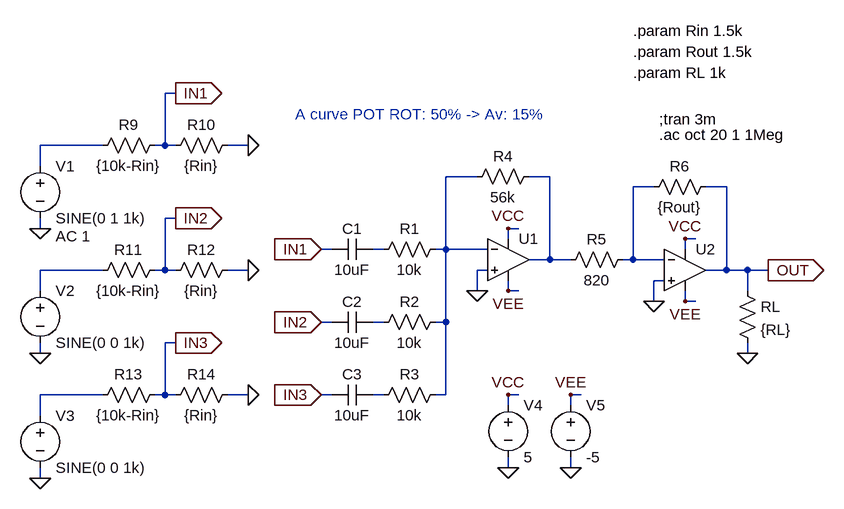
[diagram p0: schematic MIX0301.asc]
MIX0301.asc, the LTspice schematic file:
Version 4
SHEET 1 1024 708
WIRE -272 -80 -288 -80
WIRE -384 0 -480 0
WIRE -288 0 -288 -80
WIRE -288 0 -304 0
WIRE -272 0 -288 0
WIRE -160 0 -192 0
WIRE -480 32 -480 0
WIRE 192 48 144 48
WIRE 304 48 272 48
WIRE 464 64 432 64
WIRE 576 64 544 64
WIRE -272 112 -288 112
WIRE -480 128 -480 112
WIRE 256 128 240 128
WIRE 240 144 240 128
WIRE 528 144 512 144
WIRE -32 160 -48 160
WIRE 48 160 32 160
WIRE 144 160 144 48
WIRE 144 160 128 160
WIRE 208 160 144 160
WIRE 512 160 512 144
WIRE 304 176 304 48
WIRE 304 176 272 176
WIRE 336 176 304 176
WIRE 432 176 432 64
WIRE 432 176 416 176
WIRE 480 176 432 176
WIRE -384 192 -480 192
WIRE -288 192 -288 112
WIRE -288 192 -304 192
WIRE -272 192 -288 192
WIRE -160 192 -192 192
WIRE 208 192 192 192
WIRE 576 192 576 64
WIRE 576 192 544 192
WIRE 608 192 576 192
WIRE 640 192 608 192
WIRE 480 208 464 208
WIRE -480 224 -480 192
WIRE 192 224 192 192
WIRE 240 224 240 208
WIRE 256 224 240 224
WIRE 608 224 608 192
WIRE 464 240 464 208
WIRE 512 240 512 224
WIRE 528 240 512 240
WIRE -32 272 -48 272
WIRE 48 272 32 272
WIRE 144 272 144 160
WIRE 144 272 128 272
WIRE -272 304 -288 304
WIRE -480 320 -480 304
WIRE 608 320 608 304
WIRE -384 384 -480 384
WIRE -288 384 -288 304
WIRE -288 384 -304 384
WIRE -272 384 -288 384
WIRE -160 384 -192 384
WIRE -32 384 -48 384
WIRE 48 384 32 384
WIRE 144 384 144 272
WIRE 144 384 128 384
WIRE 256 384 240 384
WIRE 352 384 336 384
WIRE 240 400 240 384
WIRE 336 400 336 384
WIRE -480 416 -480 384
WIRE 240 496 240 480
WIRE 336 496 336 480
WIRE -480 512 -480 496
FLAG 192 224 0
FLAG 240 128 VCC
FLAG 240 224 VEE
FLAG -48 160 IN1
IOPIN -48 160 In
FLAG -48 272 IN2
IOPIN -48 272 In
FLAG -48 384 IN3
IOPIN -48 384 In
FLAG 640 192 OUT
IOPIN 640 192 Out
FLAG -272 -80 IN1
IOPIN -272 -80 Out
FLAG -480 128 0
FLAG -480 320 0
FLAG -480 512 0
FLAG 240 496 0
FLAG 336 496 0
FLAG 240 384 VCC
FLAG 336 384 VEE
FLAG 464 240 0
FLAG 512 144 VCC
FLAG 512 240 VEE
FLAG -160 0 0
FLAG -272 112 IN2
IOPIN -272 112 Out
FLAG -160 192 0
FLAG -272 304 IN3
IOPIN -272 304 Out
FLAG -160 384 0
FLAG 608 320 0
SYMBOL Opamps\\UniversalOpamp2 240 176 R0
SYMATTR InstName U1
SYMBOL res 144 144 R90
WINDOW 0 0 56 VBottom 2
WINDOW 3 32 56 VTop 2
SYMATTR InstName R1
SYMATTR Value 10k
SYMBOL res 144 256 R90
WINDOW 0 0 56 VBottom 2
WINDOW 3 32 56 VTop 2
SYMATTR InstName R2
SYMATTR Value 10k
SYMBOL res 144 368 R90
WINDOW 0 0 56 VBottom 2
WINDOW 3 32 56 VTop 2
SYMATTR InstName R3
SYMATTR Value 10k
SYMBOL res 288 32 R90
WINDOW 0 0 56 VBottom 2
WINDOW 3 32 56 VTop 2
SYMATTR InstName R4
SYMATTR Value 56k
SYMBOL cap 32 144 R90
WINDOW 0 0 32 VBottom 2
WINDOW 3 32 32 VTop 2
SYMATTR InstName C1
SYMATTR Value 10uF
SYMBOL cap 32 256 R90
WINDOW 0 0 32 VBottom 2
WINDOW 3 32 32 VTop 2
SYMATTR InstName C2
SYMATTR Value 10uF
SYMBOL cap 32 368 R90
WINDOW 0 0 32 VBottom 2
WINDOW 3 32 32 VTop 2
SYMATTR InstName C3
SYMATTR Value 10uF
SYMBOL voltage -480 16 R0
WINDOW 123 24 124 Left 2
WINDOW 39 0 0 Left 2
SYMATTR Value2 AC 1
SYMATTR InstName V1
SYMATTR Value SINE(0 1 1k)
SYMBOL voltage -480 208 R0
WINDOW 123 0 0 Left 2
WINDOW 39 0 0 Left 2
SYMATTR InstName V2
SYMATTR Value SINE(0 0 1k)
SYMBOL voltage -480 400 R0
WINDOW 123 0 0 Left 2
WINDOW 39 0 0 Left 2
SYMATTR InstName V3
SYMATTR Value SINE(0 0 1k)
SYMBOL voltage 240 384 R0
WINDOW 123 0 0 Left 2
WINDOW 39 0 0 Left 2
SYMATTR InstName V4
SYMATTR Value 5
SYMBOL voltage 336 384 R0
WINDOW 123 0 0 Left 2
WINDOW 39 0 0 Left 2
SYMATTR InstName V5
SYMATTR Value -5
SYMBOL res 432 160 R90
WINDOW 0 0 56 VBottom 2
WINDOW 3 32 56 VTop 2
SYMATTR InstName R5
SYMATTR Value 820
SYMBOL Opamps\\UniversalOpamp2 512 192 R0
SYMATTR InstName U2
SYMBOL res 560 48 R90
WINDOW 0 0 56 VBottom 2
WINDOW 3 32 56 VTop 2
SYMATTR InstName R6
SYMATTR Value {Rout}
SYMBOL res -288 -16 R90
WINDOW 0 0 56 VBottom 2
WINDOW 3 32 56 VTop 2
SYMATTR InstName R9
SYMATTR Value {10k-Rin}
SYMBOL res -176 -16 R90
WINDOW 0 0 56 VBottom 2
WINDOW 3 32 56 VTop 2
SYMATTR InstName R10
SYMATTR Value {Rin}
SYMBOL res -288 176 R90
WINDOW 0 0 56 VBottom 2
WINDOW 3 32 56 VTop 2
SYMATTR InstName R11
SYMATTR Value {10k-Rin}
SYMBOL res -176 176 R90
WINDOW 0 0 56 VBottom 2
WINDOW 3 32 56 VTop 2
SYMATTR InstName R12
SYMATTR Value {Rin}
SYMBOL res -288 368 R90
WINDOW 0 0 56 VBottom 2
WINDOW 3 32 56 VTop 2
SYMATTR InstName R13
SYMATTR Value {10k-Rin}
SYMBOL res -176 368 R90
WINDOW 0 0 56 VBottom 2
WINDOW 3 32 56 VTop 2
SYMATTR InstName R14
SYMATTR Value {Rin}
SYMBOL res 592 208 R0
SYMATTR InstName RL
SYMATTR Value {RL}
TEXT 472 -40 Left 2 !;tran 3m
TEXT 472 -16 Left 2 !.ac oct 20 1 1Meg
TEXT -88 -48 Left 2 ;A curve POT ROT: 50% -> Av: 15%
TEXT 432 -176 Left 2 !.param Rin 1.5k
TEXT 432 -144 Left 2 !.param Rout 1.5k
TEXT 432 -112 Left 2 !.param RL 1k

The netlist it stands for:
* MIX0301.asc
XU1 0 N002 VCC VEE N003 level.2 Avol=1Meg GBW=10Meg Slew=10Meg ilimit=25m rail=0 Vos=0 phimargin=45 en=0 enk=0 in=0 ink=0 Rin=500Meg  ; pins IN+ IN- V+ V- OUT
R1 N002 N005 10k
R2 N002 N007 10k
R3 N002 N009 10k
R4 N003 N002 56k
C1 N005 IN1 10uF
C2 N007 IN2 10uF
C3 N009 IN3 10uF
V1 N001 0 SINE(0 1 1k) AC 1
V2 N006 0 SINE(0 0 1k)
V3 N008 0 SINE(0 0 1k)
V4 VCC 0 5
V5 VEE 0 -5
R5 N004 N003 820
XU2 0 N004 VCC VEE OUT level.2 Avol=1Meg GBW=10Meg Slew=10Meg ilimit=25m rail=0 Vos=0 phimargin=45 en=0 enk=0 in=0 ink=0 Rin=500Meg  ; pins IN+ IN- V+ V- OUT
R6 OUT N004 {Rout}
R9 IN1 N001 {10k-Rin}
R10 0 IN1 {Rin}
R11 IN2 N006 {10k-Rin}
R12 0 IN2 {Rin}
R13 IN3 N008 {10k-Rin}
R14 0 IN3 {Rin}
RL OUT 0 {RL}
;tran 3m
.ac oct 20 1 1Meg
* A curve POT ROT: 50% -> Av: 15%
.param Rin 1.5k
.param Rout 1.5k
.param RL 1k
.lib UniversalOpamps2.sub
.backanno
.end